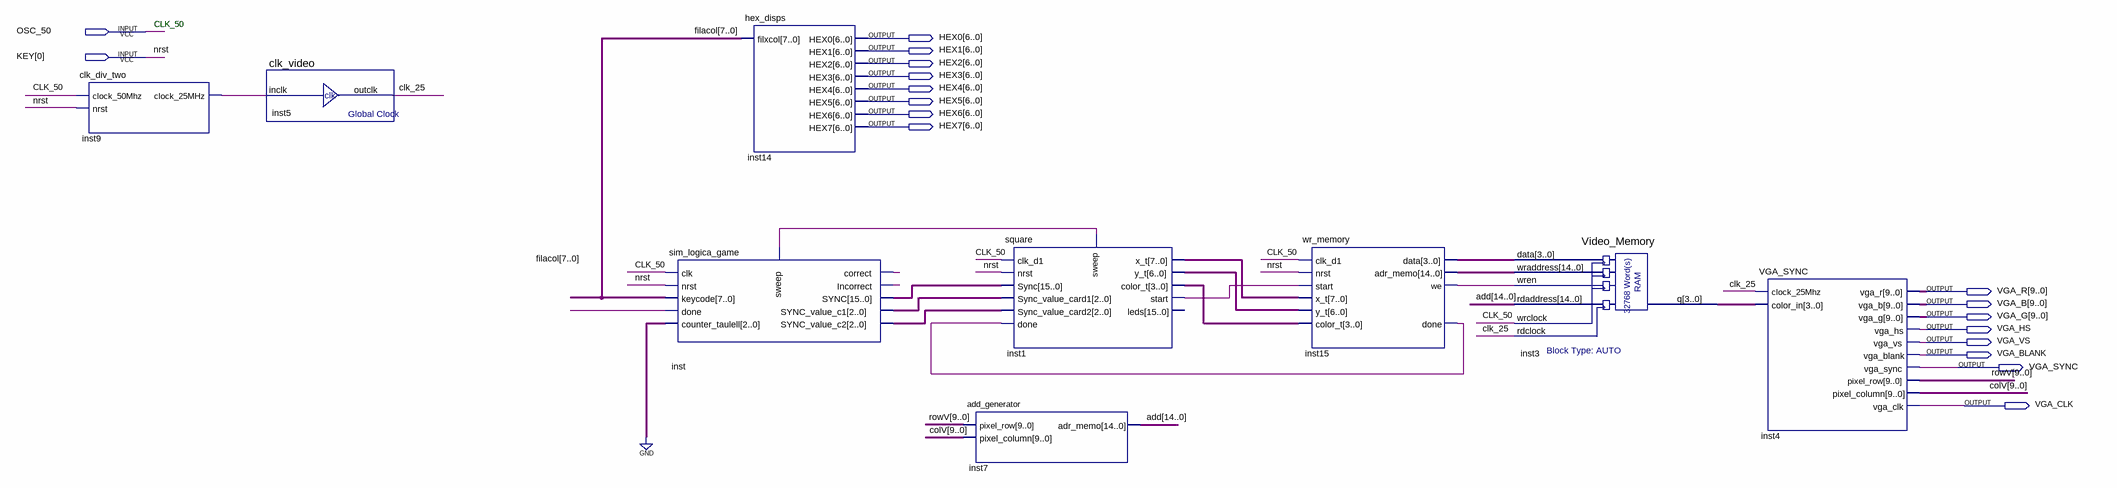
[diagram p0: schematic sheet]
// Quartus schematic sim_beta_simulation.bdf as structural Verilog: 9 symbols, 18 pins
module sim_beta_simulation (
  input  OSC_50,
  input  [0:0] KEY,
  output [6:0] HEX0,
  output [6:0] HEX1,
  output [6:0] HEX2,
  output [6:0] HEX3,
  output [6:0] HEX4,
  output [6:0] HEX5,
  output [6:0] HEX6,
  output [6:0] HEX7,
  output [9:0] VGA_R,
  output [9:0] VGA_B,
  output [9:0] VGA_G,
  output VGA_HS,
  output VGA_VS,
  output VGA_BLANK,
  output VGA_SYNC,
  output VGA_CLK
);

  wire clk_25, inst1_start, inst1_sweep, inst9_clock_25mhz, inst15_done, inst15_we, inst_correct,
       inst_incorrect, undriven;
  wire [2:0] inst_sync_value_c1, inst_sync_value_c2;
  wire [3:0] inst1_color_t, inst3_q, inst15_data;
  wire [6:0] inst1_y_t;
  wire [7:0] filacol, inst1_x_t;
  wire [9:0] colV, rowV;
  wire [14:0] add, inst15_adr_memo;
  wire [15:0] inst_sync;

  clk_div_two inst9 (.clock_50Mhz(OSC_50), .nrst(KEY[0]), .clock_25MHz(inst9_clock_25mhz));
  clk_video inst5 (.inclk(inst9_clock_25mhz), .outclk(clk_25));
  sim_logica_game inst (
    .clk(OSC_50), .nrst(KEY[0]), .keycode(filacol), .counter_taulell(3'b000), .done(undriven),
    .sweep(inst1_sweep), .correct(inst_correct), .Incorrect(inst_incorrect), .SYNC(inst_sync),
    .SYNC_value_c1(inst_sync_value_c1), .SYNC_value_c2(inst_sync_value_c2));
  hex_disps inst14 (
    .filxcol(filacol), .HEX0(HEX0), .HEX1(HEX1), .HEX2(HEX2), .HEX3(HEX3), .HEX4(HEX4), .HEX5(HEX5),
    .HEX6(HEX6), .HEX7(HEX7));
  add_generator inst7 (.pixel_row(rowV), .pixel_column(colV), .adr_memo(add));
  square inst1 (
    .clk_d1(OSC_50), .nrst(KEY[0]), .Sync(inst_sync), .Sync_value_card1(inst_sync_value_c1),
    .Sync_value_card2(inst_sync_value_c2), .done(inst15_done), .x_t(inst1_x_t), .y_t(inst1_y_t),
    .color_t(inst1_color_t), .start(inst1_start), .sweep(inst1_sweep));  // open: leds
  wr_memory inst15 (
    .clk_d1(OSC_50), .start(inst1_start), .nrst(KEY[0]), .x_t(inst1_x_t), .y_t(inst1_y_t),
    .color_t(inst1_color_t), .we(inst15_we), .done(inst15_done), .data(inst15_data),
    .adr_memo(inst15_adr_memo));
  Video_Memory inst3 (
    .data(inst15_data), .wraddress(inst15_adr_memo), .wren(inst15_we), .rdaddress(add), .wrclock(OSC_50),
    .rdclock(clk_25), .q(inst3_q));
  VGA_SYNC inst4 (
    .clock_25Mhz(clk_25), .color_in(inst3_q), .vga_r(VGA_R), .vga_b(VGA_B), .vga_g(VGA_G), .vga_hs(VGA_HS),
    .vga_vs(VGA_VS), .vga_blank(VGA_BLANK), .vga_sync(VGA_SYNC), .pixel_row(rowV), .pixel_column(colV),
    .vga_clk(VGA_CLK));

  // Other names for the same wires on the sheet: CLK_50 = OSC_50; nrst = KEY[0]

  // Notes on the sheet:
  //   CLK_50
endmodule
